# EAGLE design eagle cad tutorial rob (EAGLE 8.2.1)
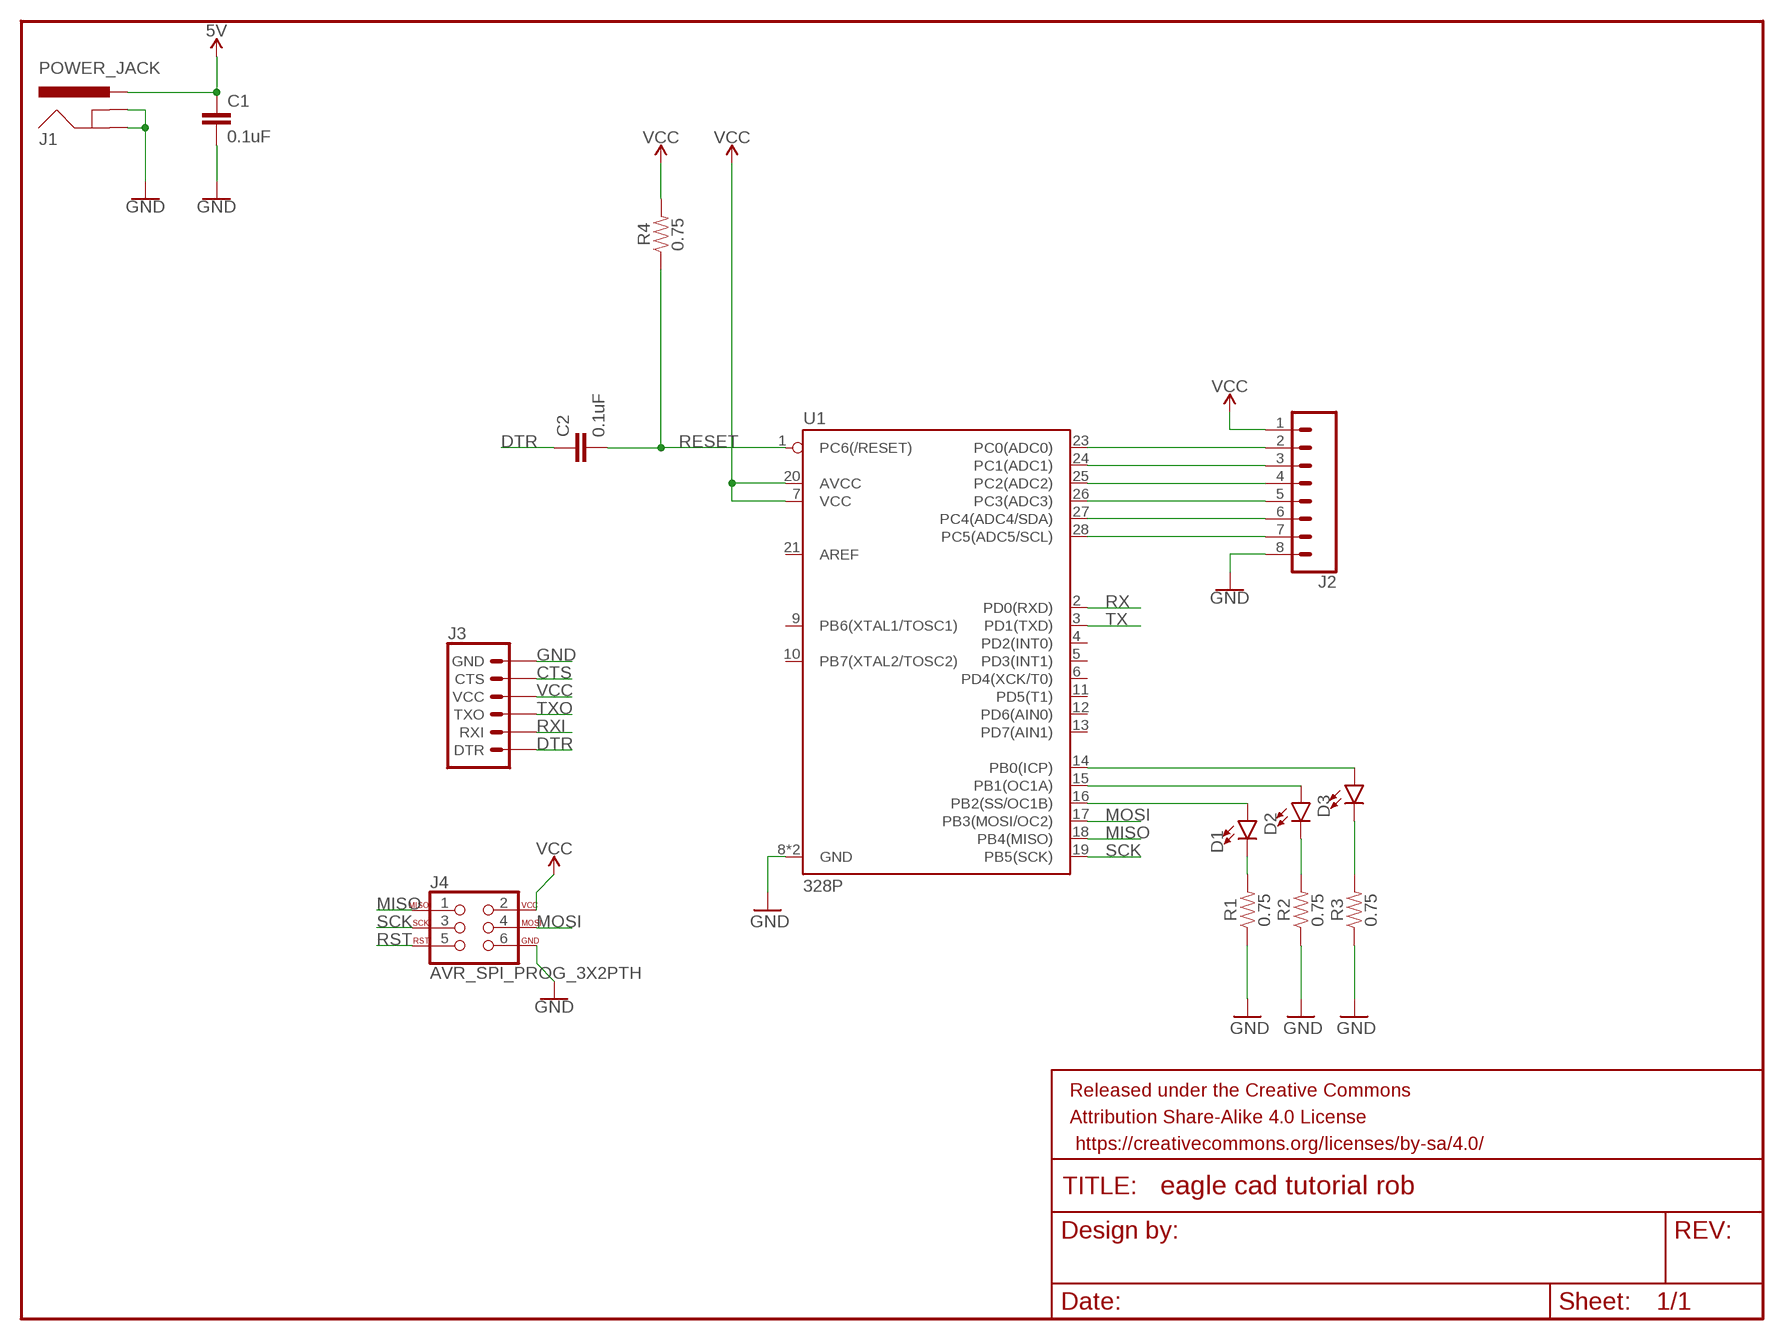
[diagram p0: schematic, sheet 1]

## Parts
C1  0.1uF  0.1UF-0402-16V-10%  [0402]
C2  0.1uF  0.1UF-0603-25V-(+80/-20%)  [0603]
D1  LED5MM  [LED_5MM]
D2  LED5MM  [LED_5MM]
D3  LED5MM  [LED_5MM]
FRAME1  FRAME-LETTER  [CREATIVE_COMMONS]
J1  POWER_JACK  [POWER_JACK_PTH]
J2  CONN_08"  [1X08]
J3  6_PIN_SERIAL_TARGETSILK  [6_PIN_SERIAL_TARGET_SIDE_W_SILK]
J4  AVR_SPI_PROG_3X2PTH  [2X3]
R1  0.75  0.75OHM-0805-1/4W-1%  [0805]
R2  0.75  0.75OHM-0805-1/4W-1%  [0805]
R3  0.75  0.75OHM-0805-1/4W-1%  [0805]
R4  0.75  0.75OHM-0805-1/4W-1%  [0805]
U1  328P  ATMEGA328P_PDIP  [DIP28]

## Nets
5V: C1.1 J1.PWR
CTS: J3.P$5(CTS)
DTR: C2.1 J3.P$1(DTR)
GND: C1.2 J1.GND J1.GNDBREAK J2.8 J3.P$6(GND) J4.6 R1.1 R2.1 R3.1 U1.8(GND) U1.22(GND)
MISO: J4.1 U1.18(PB4(MISO))
MOSI: J4.4 U1.17(PB3(MOSI/OC2))
N$1: J2.2 U1.23(PC0(ADC0))
N$3: J2.3 U1.24(PC1(ADC1))
N$4: J2.4 U1.25(PC2(ADC2))
N$5: J2.5 U1.26(PC3(ADC3))
N$6: J2.6 U1.27(PC4(ADC4/SDA))
N$7: J2.7 U1.28(PC5(ADC5/SCL))
N$8: D1.A U1.16(PB2(SS/OC1B))
N$9: D2.A U1.15(PB1(OC1A))
N$10: D3.A U1.14(PB0(ICP))
N$11: D3.K(C) R3.2
N$12: D2.K(C) R2.2
N$13: D1.K(C) R1.2
RESET: C2.2 R4.1 U1.1(PC6(/RESET))
RST: J4.5
RX: U1.2(PD0(RXD))
RXI: J3.P$3(RXI)
SCK: J4.3 U1.19(PB5(SCK))
TX: U1.3(PD1(TXD))
TXO: J3.P$2(TXO)
VCC: J2.1 J3.P$4(VCC) J4.2 R4.2 U1.7(VCC) U1.20(AVCC)
Unconnected: U1.4(PD2(INT0)) U1.5(PD3(INT1)) U1.6(PD4(XCK/T0)) U1.9(PB6(XTAL1/TOSC1)) U1.10(PB7(XTAL2/TOSC2)) U1.11(PD5(T1)) U1.12(PD6(AIN0)) U1.13(PD7(AIN1)) U1.21(AREF)

## Library data of the parts
C1 = SparkFun-Capacitors:0.1UF: 0.1µF ceramic capacitors A capacitor is a passive two-terminal electrical component used to store electrical energy temporarily in an electric field.; PROD_ID: CAP-12416
C2 = SparkFun-Capacitors:0.1UF: 0.1µF ceramic capacitors A capacitor is a passive two-terminal electrical component used to store electrical energy temporarily in an electric field.; PROD_ID: CAP-00810
D1-D3 = SparkFun-LED:LED: LED (Generic) Standard schematic elements and footprints for 5mm, 3mm, 1206, and 0603 sized LEDs. Generic LEDs with no color specified.
FRAME1 = SparkFun-Aesthetics:FRAME-LETTER: Schematic Frame - Letter Standard 8.5x11 US Letter frame
J1 = SparkFun-Connectors:POWER_JACK: Power Jack Connector This is the standard 5.5mm barrel jack for power. The PTH is the most common, proven, reliable, footprint. The Slot footprint only works if the mill layer is transmitted to the PCB fab house so be warned. Here are the connectors we sell at SparkFun: DC Barrel Power Jack/Connector <https://www.sparkfun.com/products/119> (PRT-00119) DC Barrel Power Jack/Connector (SMD) <https://www.sparkfun.com/products/12748> (PRT-12748) DC Barrel Jack Adapter - Breadboard Compatible <https://www.sparkfun.com/products/10811> (PRT-10811) It is used on this SparkFun product (and many, many others): SparkFun RedBoard - Programmed with Arduino <https://www.sparkfun.com/products/12757> (DEV-12757) Also, if you need a mating power supply or connector, please check these out: Wall Adapter Power Supply - 9VDC 650mA <https://www.sparkfun.com/products/298> (TOL-00298) DC Barrel Jack Adapter - Male <https://www.sparkfun.com/products/10287> (PRT-10287); PROD_ID: CONN-08197
J2 = SparkFun-Connectors:CONN_08: Multi connection point. Often used as Generic Header-pin footprint for 0.1 inch spaced/style header connections On any of the 0.1 inch spaced packages, you can populate with these: Break Away Headers - Straight <https://www.sparkfun.com/products/116> (PRT-00116) Break Away Male Headers - Right Angle <https://www.sparkfun.com/products/553> (PRT-00553) Female Headers <https://www.sparkfun.com/products/115> (PRT-00115) Break Away Headers - Machine Pin <https://www.sparkfun.com/products/117> (PRT-00117) Break Away Female Headers - Swiss Machine Pin <https://www.sparkfun.com/products/743> (PRT-00743) Arduino Stackable Header - 8 Pin <https://www.sparkfun.com/products/9279> (PRT-09279) For SCREWTERMINALS and SPRING TERMINALS visit here: Screw Terimnals on SparkFun.com <https://www.sparkfun.com/search/results?term=Screw+Terminals> (5mm/3.5mm/2.54mm spacing) This device is also useful as a general connection point to wire up your design to another part of your project. Our various solder wires solder well into these plated through hole pads. Hook-Up Wire - Assortment (Stranded, 22 AWG) <https://www.sparkfun.com/products/11375> (PRT-11375) Hook-Up Wire - Assortment (Solid Core, 22 AWG) <https://www.sparkfun.com/products/11367> (PRT-11367) View the entire wire category on our website here <https://www.sparkfun.com/categories/141> Special notes: Molex polarized connector foot print use with SKU : PRT-08231 with associated crimp pins and housings. 1MM SMD Version SKU: PRT-10208 NOTES ON THE VARIANTS LOCK and LOCK_LONGPADS... This footprint was designed to help hold the alignment of a through-hole component (i.e. 6-pin header) while soldering it into place. You may notice that each hole has been shifted either up or down by 0.005 of an inch from it's more standard position (which is a perfectly straight line). This slight alteration caused the pins (the squares in the middle) to touch the edges of the holes. Because they are alternating, it causes a "brace" to hold the component in place. 0.005 has proven to be the perfect amount of "off-center" position when using our standard breakaway headers. Although looks a little odd when you look at the bare footprint, once you have a header in there, the alteration is very hard to notice. Also,if you push a header all the way into place, it is covered up entirely on the bottom side.; PROD_ID: CONN-08438
J3 = SparkFun-Connectors:6_PIN_SERIAL_TARGET: 6-pin header connection for use with the "FTDI BASIC" pinout - TARGET SIDE. Also known as "Arduino Serial Program Header". It is used to mate with our FTDI Basic serial programmers using the Arduino IDE. Note, this device has "TARGET" in the name. It is intended to be used on a design that contains a target micro-controller that you wish to program. The "sister" device, named "CABLE" is inteneded to be used on a design that usually lives on the end of your USB cable and prvides the converter chip (FTDI232 or FTDI231x) to commnicate serial RX/TX. You can populate with some of these: Break Away Headers - Straight <https://www.sparkfun.com/products/116> (PRT-00116) For reference (or to suit your programming needs) check out these designs: SparkFun FTDI Basic Breakout - 5V <https://www.sparkfun.com/products/9716> (DEV-09716) SparkFun FTDI Basic Breakout - 3.3V <https://www.sparkfun.com/products/9873> (DEV-09873) SparkFun FTDI SmartBasic <https://www.sparkfun.com/products/12935> (DEV-12935) SparkFun Beefy 3 - FTDI Basic Breakout <https://www.sparkfun.com/products/13746> (DEV-13746)
J4 = SparkFun-Connectors:AVR_SPI_PROG_3X2: AVR ISP 6 Pin This is the reduced ISP connector for AVR programming. Common on Arduino. This footprint will take up less PCB space and can be used with a 10-pin to 6-pin adapter such as SKU: BOB-08508 **Special note about "TEST_POINT" package. The stop mask is on the top side, so if you want your programming test points to be on the bottom of your board, make sure to place this package on the bottom side of the board. This also ensure that the orientation to program from the bottom side will be correct. SparkFun Products: SparkFun ISP Pogo Adapter <https://www.sparkfun.com/products/11591> - NS Tiny AVR Programmer <https://www.sparkfun.com/products/11801> -PTH
R1-R4 = SparkFun-Resistors:0.75OHM: 0.75Ω resistor A resistor is a passive two-terminal electrical component that implements electrical resistance as a circuit element. Resistors act to reduce current flow, and, at the same time, act to lower voltage levels within circuits. - Wikipedia; PROD_ID: RES-08474
U1 = SparkFun-IC-Microcontroller:ATMEGA328P_PDIP: Atmel 328P Through hole ATMEGA328P uC used in the Arduino 32kb flash, 1k EEPROM, 2k SRAM Datasheet <http://www.sparkfun.com/datasheets/Components/SMD/ATMega328.pdf> SparkFun Products Storefront component: AVR 28 Pin 20MHz 32K 6A/D - ATMega328P <https://www.sparkfun.com/products/9061> (COM-09061) SparkFun Simon Says - Through-Hole Soldering Kit <https://www.sparkfun.com/products/10547> (KIT-10547) SparkFun Learn to Solder - Simon Says <https://www.sparkfun.com/products/13708> (KIT-13708) SparkFun BigTime Watch Kit <https://www.sparkfun.com/products/11734> (KIT-11734) SparkFun ClockIt <https://www.sparkfun.com/products/10930> (KIT-10930) SparkFun Serial Enabled LCD Kit <https://www.sparkfun.com/products/10097> (LCD-10097) SparkFun Simon Tilts - Through Hole Soldering Kit <https://www.sparkfun.com/products/12634> (KIT-12634) SparkFun Frequency Counter Kit <https://www.sparkfun.com/products/10140> (KIT-10140) FabFM Radio Kit <https://www.sparkfun.com/products/11043> (KIT-11043) SparkFun Binary Blaster Kit <https://www.sparkfun.com/products/12037> (KIT-12037) SparkFun Metro-Gnome <https://www.sparkfun.com/products/9236> (KIT-09236) ATmega328 with Arduino Optiboot (Uno) <https://www.sparkfun.com/products/10524> (DEV-10524); PROD_ID: IC-09136

## Board
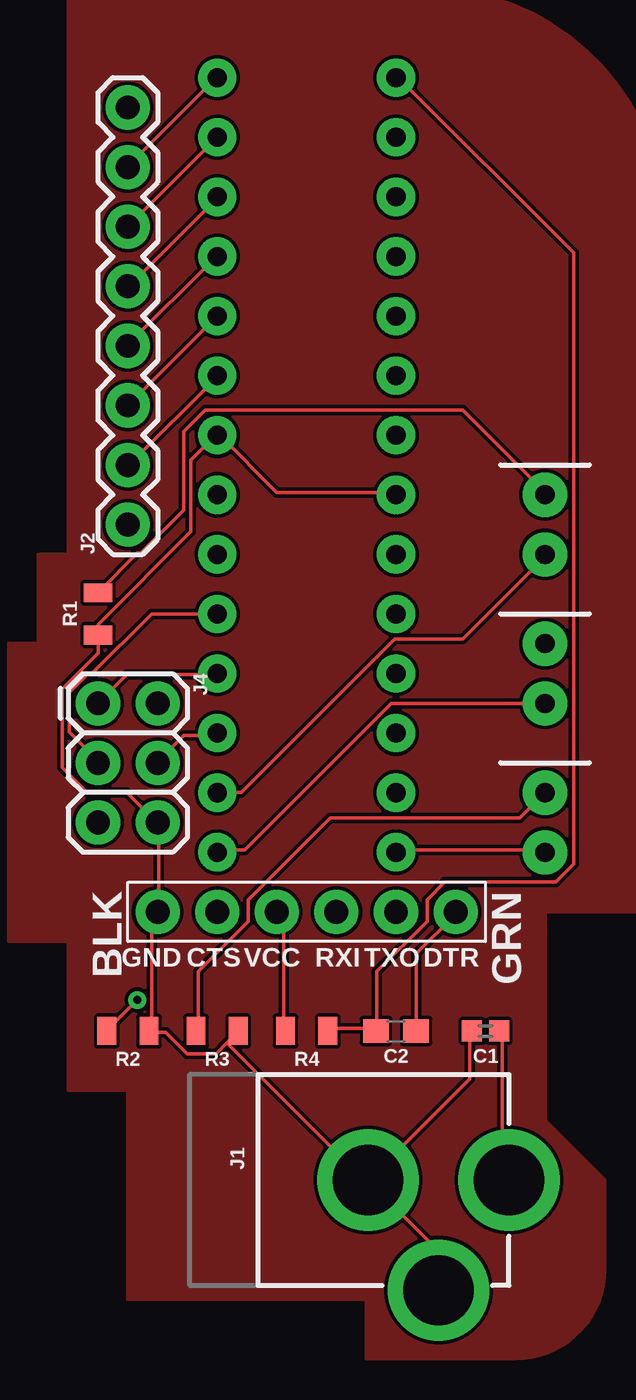
[diagram p1: board, top side]
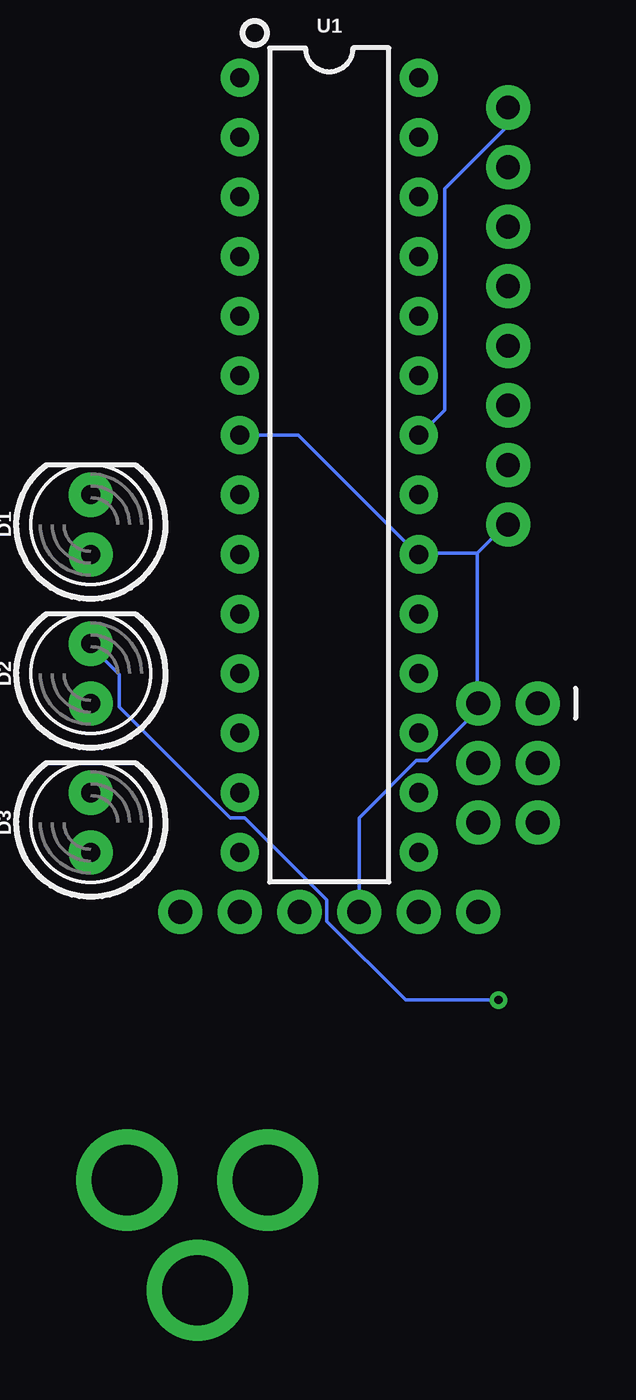
[diagram p2: board, bottom side, seen from below]

No outline drawn. Coordinates in mm, seen from the top.
Copper layers (1*16): Top 0.035mm / dielectric 1.5mm / Bottom 0.035mm
Design rules "default": minimum track width 6mil, minimum drill 0.35mm, track to track 6mil, track to pad 6mil, pad to pad 6mil, via to via 6mil, smd to smd 6mil, copper to edge 40mil, drill to drill 6mil, minimum pad ring 10mil, minimum via ring 8mil, stop-mask expansion 4mil, vias tented up to drill 0mil, thermal gap 10mil

### Footprints (pad centres in the part's own frame; a part is rotated, then mirrored left to right if it is on the bottom)
0402 = smd 0.85 x 0.9: 1 -0.58,0; 2 0.58,0
0603 = smd 1.1 x 1: 1 -0.85,0; 2 0.85,0
LED_5MM = drill 0.813 pad 1.88: A -1.27,0; K 1.27,0
POWER_JACK_PTH = drill 2.997 pad 4.318: GND 0,7.7; GNDBREAK 4.7,10.7; PWR 0,13.7
1X08 = drill 1.016 pad 1.88: 1 0,0; 2 2.54,0; 3 5.08,0; 4 7.62,0; 5 10.16,0; 6 12.7,0; 7 15.24,0; 8 17.78,0
6_PIN_SERIAL_TARGET_SIDE_W_SILK = drill 1.016 pad 1.88: P$1 -6.35,0; P$2 -3.81,0; P$3 -1.27,0; P$4 1.27,0; P$5 3.81,0; P$6 6.35,0
2X3 = drill 1.016 pad 1.88: 1 0,0; 2 0,2.54; 3 2.54,0; 4 2.54,2.54; 5 5.08,0; 6 5.08,2.54
0805 = smd 0.8 x 1.2: 1 -0.9,0; 2 0.9,0
DIP28 = drill 0.813 pad 1.626: 1 -16.51,-3.81; 2 -13.97,-3.81; 3 -11.43,-3.81; 4 -8.89,-3.81; 5 -6.35,-3.81; 6 -3.81,-3.81; 7 -1.27,-3.81; 8 1.27,-3.81; 9 3.81,-3.81; 10 6.35,-3.81; 11 8.89,-3.81; 12 11.43,-3.81; 13 13.97,-3.81; 14 16.51,-3.81; 15 16.51,3.81; 16 13.97,3.81; 17 11.43,3.81; 18 8.89,3.81; 19 6.35,3.81; 20 3.81,3.81; 21 1.27,3.81; 22 -1.27,3.81; 23 -3.81,3.81; 24 -6.35,3.81; 25 -8.89,3.81; 26 -11.43,3.81; 27 -13.97,3.81; 28 -16.51,3.81

### Placement (x,y rotation side)
C1  43.18,8.89 180 top
C2  39.37,8.89 180 top
D1  45.72,30.48 90 bottom
D2  45.72,24.13 90 bottom
D3  45.72,17.78 90 bottom
FRAME1  66.04,110.49 270 top
J1  30.48,2.54 270 top
J2  27.94,30.48 90 top
J3  35.56,13.97 180 top
J4  26.67,22.86 270 top
R1  26.67,26.67 90 top
R2  27.94,8.89 180 top
R3  31.75,8.89 180 top
R4  35.56,8.89 180 top
U1  35.56,33.02 270 bottom

### Tracks (layer width: path | path; a pad name or v marks a point on that pad's centre or on a via)
5V
  Top 0.152: C1.1 43.89,8.84 43.89,2.74 44.04,2.59 J1.PWR
DTR
  Top 0.152: C2.1 40.23,8.99 40.23,12.19 41.91,13.87 J3.P$1
GND
  Top 0.152: U1.8 39.32,31.85 34.29,31.85 31.85,34.29 U1.22 31.7,34.29 30.63,33.22 30.63,30.18 26.67,26.21 R1.1 26.67,24.99 25.15,23.47 25.15,20.12 26.21,19.05 27.89,19.05 29.11,17.83 J4.6 29.26,17.68 29.26,14.02 J3.P$6 28.96,13.72 28.96,8.99 R2.1 28.96,8.84 29.57,8.84 30.48,7.92 31.7,7.92 32.16,8.38 | 32.16,8.38 32.61,8.84 R3.1 | C1.2 42.52,8.84 42.52,6.86 38.25,2.59 J1.GND | 32.16,8.38 38.1,2.44 J1.GND | J1.GNDBREAK 41.15,-2.13 41.15,-0.46 38.25,2.44 J1.GND
  Bottom 0.152: J2.8 28.04,48.16 28.04,47.4 30.63,44.81 30.63,35.36 31.7,34.29 U1.22
MISO
  Top 0.152: J4.1 27.89,24.08 31.7,24.08 U1.18
MOSI
  Top 0.152: U1.17 31.7,21.49 30.33,21.49 29.26,20.42 J4.4
N$1
  Top 0.152: U1.23 31.7,36.73 28.04,33.07 J2.2
N$2
  pour Top: 25.4,53.34 40.64,53.34 arc-90 50.8,43.18 50.8,13.97 45.72,13.97 45.72,5.08 48.26,2.54 48.26,-1.27 arc-90 44.45,-5.08 38.1,-5.08 38.1,-2.54 27.94,-2.54 27.94,6.35 25.4,6.35 25.4,12.7 22.86,12.7 22.86,25.4 24.13,25.4 24.13,29.21 25.4,29.21
N$3
  Top 0.152: J2.3 U1.24
N$4
  Top 0.152: U1.25 31.7,41.91 27.89,38.1 J2.4
N$5
  Top 0.152: U1.26 31.7,44.35 28.04,40.69 J2.5
N$6
  Top 0.152: J2.6 U1.27
N$7
  Top 0.152: U1.28 31.7,49.53 27.89,45.72 J2.7
N$8
  Top 0.152: U1.16 32.77,19.05 39.32,25.6 42.22,25.6 45.72,29.11 D1.A
N$9
  Top 0.152: D2.A 39.17,22.86 32.92,16.61 31.85,16.61 U1.15
N$10
  Top 0.152: U1.14 39.47,16.61 45.72,16.61 D3.A
N$11
  Top 0.152: D3.K 44.65,17.98 36.58,17.98 33.07,14.48 33.07,13.56 30.94,11.43 30.94,8.99 R3.2
N$12  (via drill 0.35)
  Top 0.152: v28.35,10.21 27.13,8.99 R2.2
  Bottom 0.152: v28.35,10.21 32.31,10.21 35.66,13.56 35.66,14.48 39.17,17.98 39.78,17.98 44.5,22.71 44.5,24.08 45.72,25.3 D2.K
N$13
  Top 0.152: R1.2 26.67,27.58 28.35,29.26 28.5,29.26 30.33,31.09 30.33,34.44 31.24,35.36 42.22,35.36 45.72,31.85 D1.K
RESET
  Top 0.152: R4.1 36.58,8.99 38.41,8.99 C2.2 38.56,8.99 38.56,11.43 40.69,13.56 40.69,14.48 41.45,15.24 46.18,15.24 46.94,16 46.94,42.06 39.47,49.53 U1.1
SCK
  Top 0.152: U1.19 28.96,26.67 26.36,24.08 26.21,24.08 25.45,23.32 25.45,21.64 26.67,20.42 J4.3
VCC
  Top 0.152: R4.2 34.59,8.99 34.59,13.56 34.29,13.87 J3.P$4
  Bottom 0.152: 29.26,29.26 31.7,29.26 U1.20 31.85,29.26 36.88,34.29 U1.7 | 29.26,29.26 28.04,30.48 J2.1 | 29.26,29.26 29.26,22.86 | J3.P$4 34.29,17.98 31.85,20.42 31.39,20.42 29.26,22.55 29.26,22.86 | 29.26,22.86 J4.2